# EAGLE design TEST_CPU (EAGLE 9.6.2)
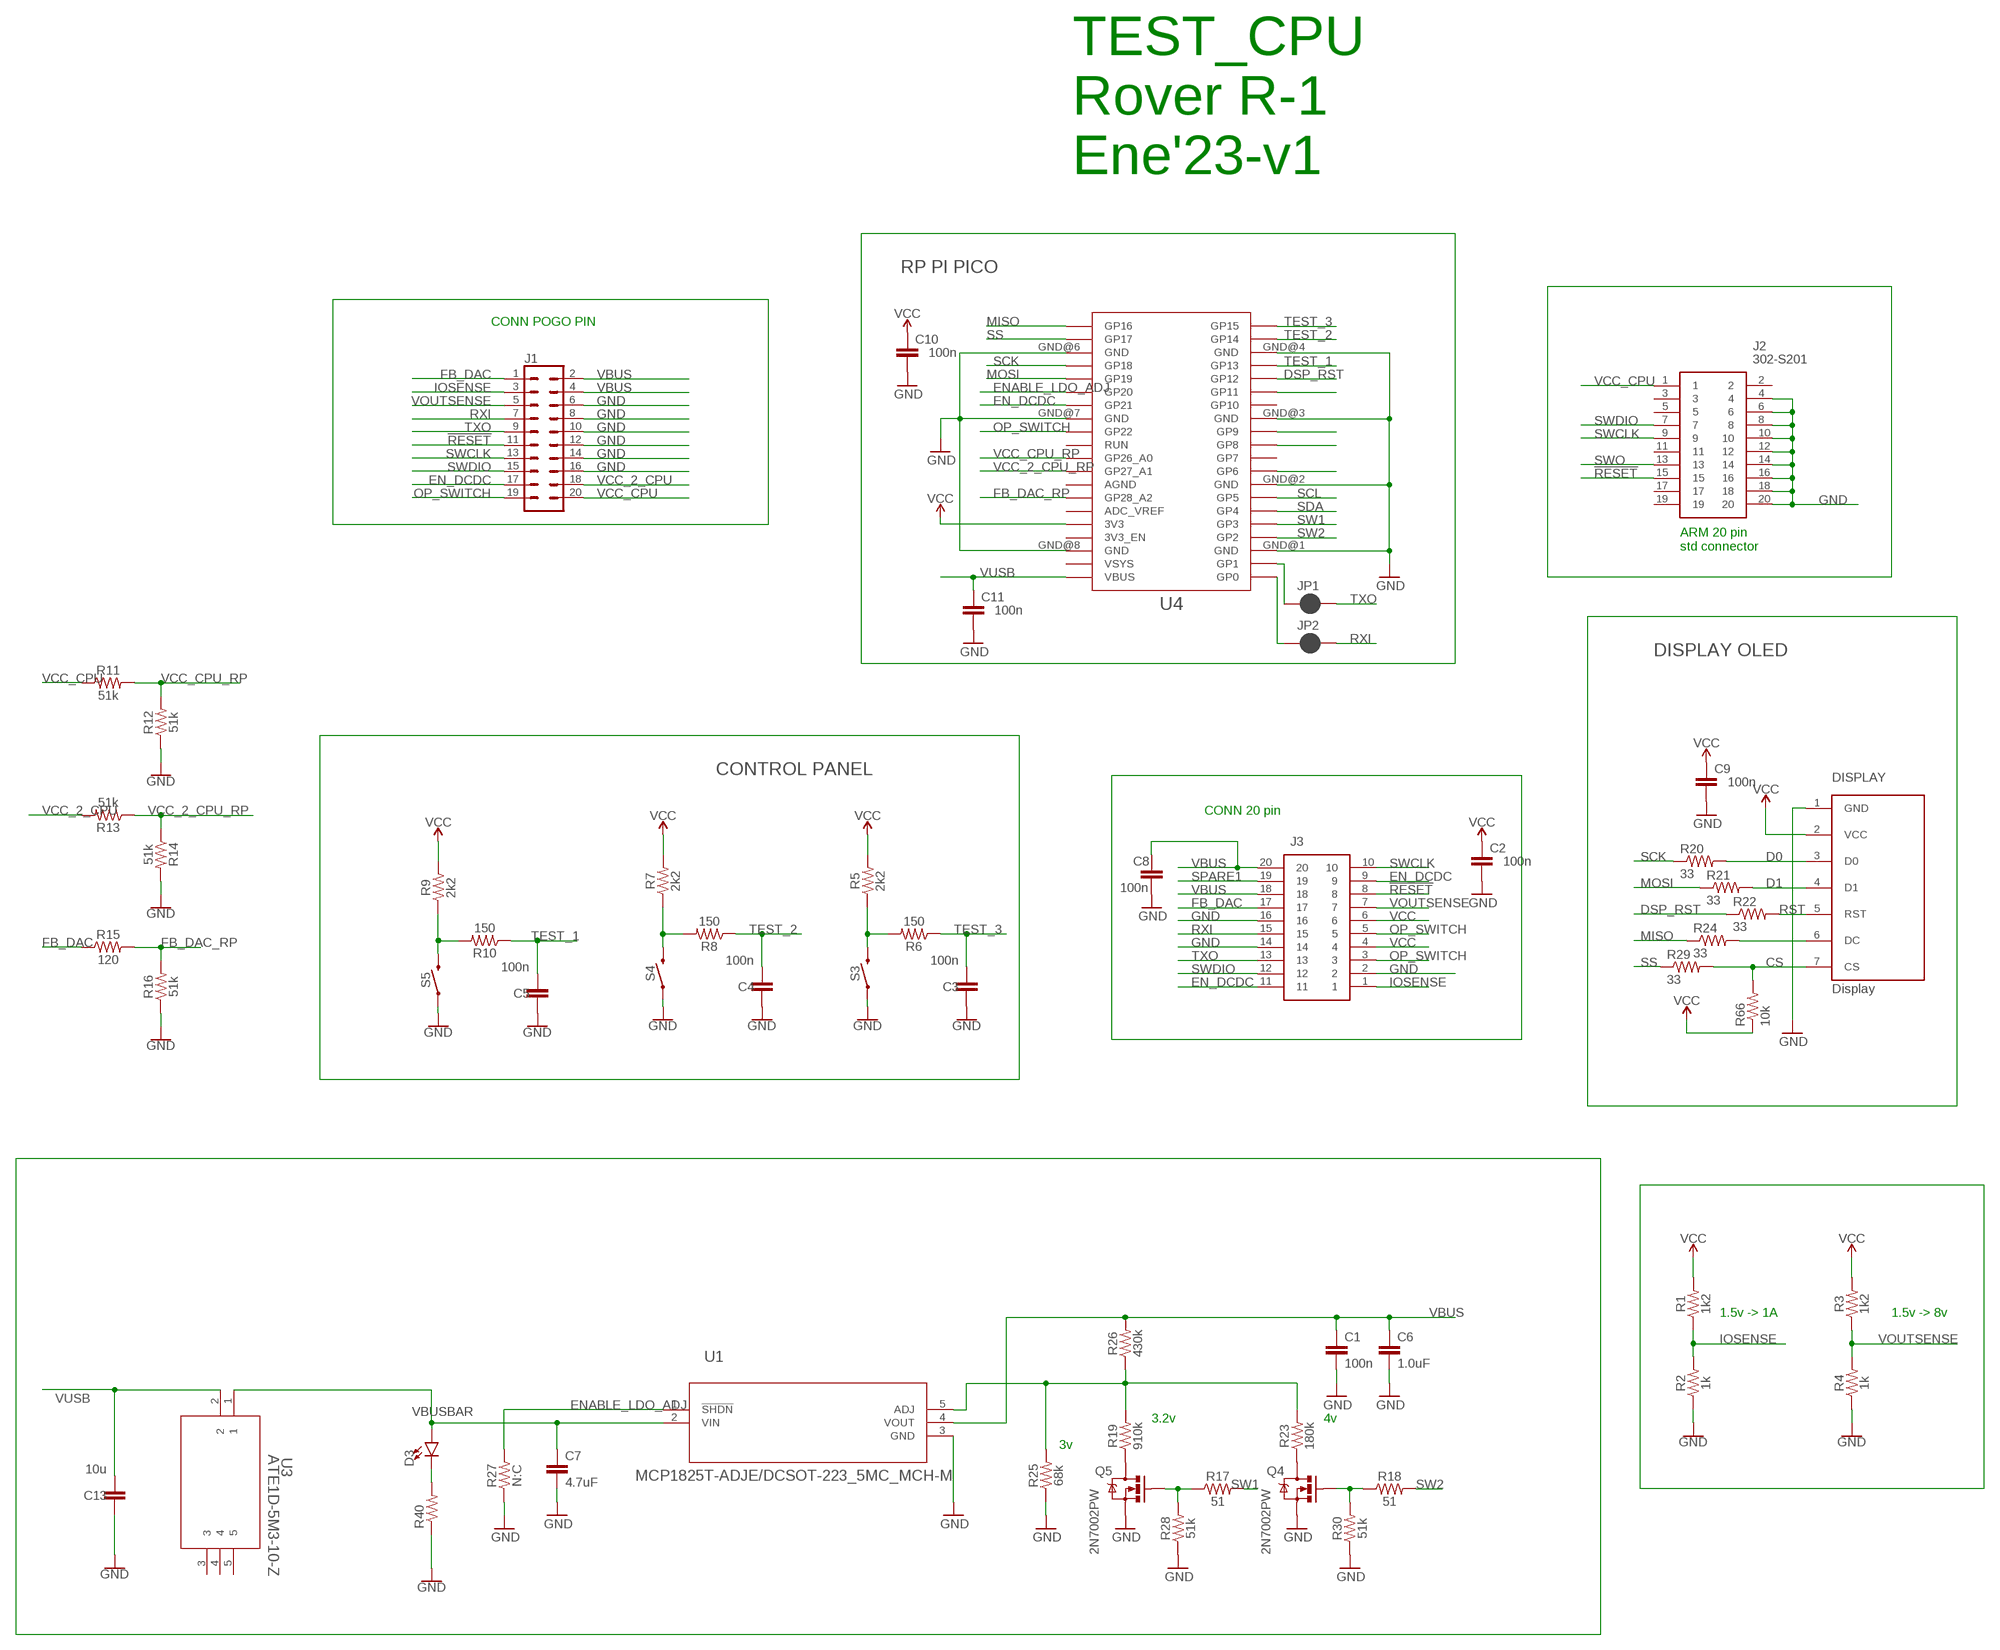
[diagram p0: schematic, sheet 1]

## Parts
C1  100n  1.0UF-0805-25V-(+80/-20%)  [0805]
C2  100n  1.0UF-0805-25V-(+80/-20%)  [0805]
C3  100n  1.0UF-0805-25V-(+80/-20%)  [0805]
C4  100n  1.0UF-0805-25V-(+80/-20%)  [0805]
C5  100n  1.0UF-0805-25V-(+80/-20%)  [0805]
C6  1.0uF  1.0UF-0805-25V-(+80/-20%)  [0805]
C7  4.7uF  1.0UF-0805-25V-(+80/-20%)  [0805]
C8  100n  1.0UF-0805-25V-(+80/-20%)  [0805]
C9  100n  1.0UF-0805-25V-(+80/-20%)  [0805]
C10  100n  1.0UF-0805-25V-(+80/-20%)  [0805]
C11  100n  1.0UF-0805-25V-(+80/-20%)  [0805]
C13  10u  1.0UF-0805-25V-(+80/-20%)  [0805]
D3  LED3MM  [LED_3MM]
DISPLAY  Display  OLED_LCD  [OLED_LCD]
J1  CONN_10X2  [2X10]
J2  302-S201  [SHDR20W66P254_2X10_3300X905X90]
J3  DF40C-20DP-0.4V_51_  [DF40C-20DPA]
JP1  JUMPER-SMT_2_NC_PASTE_SILK  [SMT-JUMPER_2_NC_PASTE_SILK]
JP2  JUMPER-SMT_2_NC_PASTE_SILK  [SMT-JUMPER_2_NC_PASTE_SILK]
Q4  2N7002PW  MOSFET-NCHANNEL2N7002PW  [SOT323]
Q5  2N7002PW  MOSFET-NCHANNEL2N7002PW  [SOT323]
R1  1k2  RESISTOR0805  [0805]
R2  1k  RESISTOR0805  [0805]
R3  1k2  RESISTOR0805  [0805]
R4  1k  RESISTOR0805  [0805]
R5  2k2  RESISTOR0805  [0805]
R6  150  RESISTOR0805  [0805]
R7  2k2  RESISTOR0805  [0805]
R8  150  RESISTOR0805  [0805]
R9  2k2  RESISTOR0805  [0805]
R10  150  RESISTOR0805  [0805]
R11  51k  RESISTOR0805  [0805]
R12  51k  RESISTOR0805  [0805]
R13  51k  RESISTOR0805  [0805]
R14  51k  RESISTOR0805  [0805]
R15  120  RESISTOR0805  [0805]
R16  51k  RESISTOR0805  [0805]
R17  51  RESISTOR0805  [0805]
R18  51  RESISTOR0805  [0805]
R19  910k  RESISTOR0805  [0805]
R20  33  RESISTOR0805  [0805]
R21  33  RESISTOR0805  [0805]
R22  33  RESISTOR0805  [0805]
R23  180k  RESISTOR0805  [0805]
R24  33  RESISTOR0805  [0805]
R25  68k  RESISTOR0805  [0805]
R26  430k  RESISTOR0805  [0805]
R27  N:C  RESISTOR0805  [0805]
R28  51k  RESISTOR0805  [0805]
R29  33  RESISTOR0805  [0805]
R30  51k  RESISTOR0805  [0805]
R40  360  RESISTOR0805  [0805]
R66  10k  RESISTOR0805  [0805]
S3  MOMENTARY-SWITCH-SPST-SMD-5.2MM  [TACTILE_SWITCH_SMD_5.2MM]
S4  MOMENTARY-SWITCH-SPST-SMD-5.2MM  [TACTILE_SWITCH_SMD_5.2MM]
S5  MOMENTARY-SWITCH-SPST-SMD-5.2MM  [TACTILE_SWITCH_SMD_5.2MM]
U1  MCP1825T-ADJE/DCSOT-223_5MC_MCH-M  [SOT-223_5MC_MCH-M]
U3  ATE1D-5M3-10-Z  [SPDT05_ATE1D_9P5X8_NDC]
U4  RPI_PICO_IG-TH  [RPI_PICO_TH]

## Nets
!RESET: J1.11 J2.15 J3.8
CS: DISPLAY.7(CS) R29.2 R66.2
D0: DISPLAY.3(D0) R20.2
D1: DISPLAY.4(D1) R21.2
DSP_RST: R22.1 U4.GP12
EN_DCDC: J1.17 J3.9 J3.11 U4.GP21
ENABLE_LDO_ADJ: R27.2 U1.1(!SHDN) U4.GP20
FB_DAC: J1.1 J3.17 R15.1
FB_DAC_RP: R15.2 R16.2 U4.GP28_A2
GND: C1.2 C2.2 C3.1 C4.1 C5.1 C6.2 C7.2 C8.2 C9.2 C10.2 C11.2 C13.1 DISPLAY.1(GND) J1.6 J1.8 J1.10 J1.12 J1.14 J1.16 J2.4 J2.6 J2.8 J2.10 J2.12 J2.14 J2.16 J2.18 J2.20 J3.2 J3.14 J3.16 Q4.2(S) Q5.2(S) R2.1 R4.1 R12.1 R14.2 R16.1 R25.1 R27.1 R28.1 R30.1 R40.1 S3.1 S4.1 S5.1 U1.3(GND) U4.GND@1(GND) U4.GND@2(GND) U4.GND@3(GND) U4.GND@4(GND) U4.GND@6(GND) U4.GND@7(GND) U4.GND@8(GND)
IOSENSE: J1.3 J3.1 R1.1 R2.2
MISO: R24.1 U4.GP16
MOSI: R21.1 U4.GP19
N$5: R5.1 R6.2 S3.3
N$7: R7.1 R8.2 S4.3
N$8: JP1.1 U4.GP1
N$9: R9.1 R10.2 S5.3
N$10: JP2.1 U4.GP0
N$11: U4.GP11
N$17: DISPLAY.6(DC) R24.2
N$20: U4.GP6
N$21: R19.2 R23.2 R25.2 R26.1 U1.5(ADJ)
N$22: U4.GP8
N$23: U4.GP9
N$27: Q5.1(G) R17.1 R28.2
N$28: D3.K(C) R40.2
N$29: Q5.3(D) R19.1
N$34: Q4.1(G) R18.1 R30.2
N$35: Q4.3(D) R23.1
OP_SWITCH: J1.19 J3.3 J3.5 U4.GP22
RST: DISPLAY.5(RST) R22.2
RXI: J1.7 J3.15 JP2.2
SCK: R20.1 U4.GP18
SCL: U4.GP5
SDA: U4.GP4
SPARE1: J3.19
SS: R29.1 U4.GP17
SW1: R17.2 U4.GP3
SW2: R18.2 U4.GP2
SWCLK: J1.13 J2.9 J3.10
SWDIO: J1.15 J2.7 J3.12
SWO: J2.13
TEST_1: C5.2 R10.1 U4.GP13
TEST_2: C4.2 R8.1 U4.GP14
TEST_3: C3.2 R6.1 U4.GP15
TXO: J1.9 J3.13 JP1.2
VBUS: C1.1 C6.1 C8.1 J1.2 J1.4 J3.18 J3.20 R26.2 U1.4(VOUT)
VBUSBAR: C7.1 D3.A U1.2(VIN) U3.1
VCC: C2.1 C9.1 C10.1 DISPLAY.2(VCC) J3.4 J3.6 R1.2 R3.2 R5.2 R7.2 R9.2 R66.1 U4.3V3
VCC_2_CPU: J1.18 R13.2
VCC_2_CPU_RP: R13.1 R14.1 U4.GP27_A1
VCC_CPU: J1.20 J2.1 R11.1
VCC_CPU_RP: R11.2 R12.2 U4.GP26_A0
VOUTSENSE: J1.5 J3.7 R3.1 R4.2
VUSB: C11.1 C13.2 U3.2 U4.VBUS
Unconnected: J2.2 J2.3 J2.5 J2.11 J2.17 J2.19 U3.3 U3.4 U3.5 U4.3V3_EN U4.ADC_VREF U4.AGND U4.GP7 U4.GP10 U4.RUN U4.VSYS

## Notes on the sheet
- TEST_CPU
  Rover R-1
  Ene'23-v1
- RP PI PICO
- CONN POGO PIN
- ARM 20 pin
  std connector
- DISPLAY OLED
- CONTROL PANEL
- CONN 20 pin
- 1.5v -> 1A | 1.5v -> 8v
- 3.2v | 4v
- 3v

## Library data of the parts
C1-C5 C7-C11 C13 = SparkFun-Capacitors:1.0UF: 1µF ceramic capacitors A capacitor is a passive two-terminal electrical component used to store electrical energy temporarily in an electric field.; PROD_ID: CAP-11625; VALUE: 1.0uF
C6 = SparkFun-Capacitors:1.0UF: 1µF ceramic capacitors A capacitor is a passive two-terminal electrical component used to store electrical energy temporarily in an electric field.; PROD_ID: CAP-11625
D3 = SparkFun-LED:LED: LED (Generic) Standard schematic elements and footprints for 5mm, 3mm, 1206, and 0603 sized LEDs. Generic LEDs with no color specified.; PROD_ID: DIO-08794
DISPLAY = EDCPSU:OLED_LCD
J1 = SparkFun-Connectors:CONN_10X2: Multi connection point. Often used as Generic Header-pin footprint for 0.1 inch spaced/style header connections On any of the 0.1 inch spaced packages, you can populate with these: Break Away Headers - Straight <https://www.sparkfun.com/products/116> (PRT-00116) Break Away Male Headers - Right Angle <https://www.sparkfun.com/products/553> (PRT-00553) Female Headers <https://www.sparkfun.com/products/115> (PRT-00115) Break Away Headers - Machine Pin <https://www.sparkfun.com/products/117> (PRT-00117) Break Away Female Headers - Swiss Machine Pin <https://www.sparkfun.com/products/743> (PRT-00743) Special note about the "SPECIAL" package: This was SPECIALLY designed to be used with our Graphic LCD Backpack. Be sure you want to use this! It is not only staggered on each line of header holes, but IT IS ALSO offset of the center point of the top and bottom lines by 5 mil. This causes the headers to lock into place on the "standard" footprint on the LCD screen. The extra squares on the tdocu layer are there simply to reference other pins (if you were to actually populate a longer header than ten long - this is what we do with the backpacks).
J2 = 302-S201:302-S201: CONN HEADER VERT 20POS GOLD Source: Datasheet <http://www.on-shore.com/wp-content/uploads/2018/04/302-SXX1.pdf>; DESCRIPTION: CONN HEADER VERT 20POS GOLD; HEIGHT: 9.05mm; MANUFACTURER_NAME: On Shore Technology Inc.; MANUFACTURER_PART_NUMBER: 302-S201
J3 = DF40C-20DP-0.4V_51_:DF40C-20DP-0.4V_51_: HIROSE(HRS) - DF40C-20DP-0.4V(51) - CONNECTOR, STACKING, HEADER, 20POS, 2ROW Source: Datasheet <https://datasheet.datasheetarchive.com/originals/distributors/Datasheets-DGA17/1059795.pdf>; ARROW_PART_NUMBER: DF40C-20DP-0.4V(51); ARROW_PRICE-STOCK: https://www.arrow.com/en/products/df40c-20dp-0.4v-51/hirose-electric; DESCRIPTION: HIROSE(HRS) - DF40C-20DP-0.4V(51) - CONNECTOR, STACKING, HEADER, 20POS, 2ROW; HEIGHT: mm; MANUFACTURER_NAME: Hirose; MANUFACTURER_PART_NUMBER: DF40C-20DP-0.4V(51); MOUSER_PART_NUMBER: 798-DF40C20DP0.4V51; MOUSER_PRICE-STOCK: https://www.mouser.co.uk/ProductDetail/Hirose-Connector/DF40C-20DP-0.4V51?qs=eDUdFcBPps31lPFyZ%252BXRFg%3D%3D
JP1 JP2 = SparkFun-Jumpers:JUMPER-SMT_2_NC_PASTE: Normally closed solder jumper This jumper has an aperture in the stencil to allow solder paste to bridge the split in the wire so it's normally closed (NC). Wick off the solder to open the connection. Reapply solder to reclose the connection.
Q4 Q5 = SparkFun-DiscreteSemi:MOSFET-NCHANNEL: Common NMOSFET Parts MFG P/N Store ID Prod ID FDD8780 TRANS-09984 SI7820DN TRANS-11055 FDS6630A IC-08089 2N7002PW TRANS-11151 FQP30N06L COM-10213 TRANS-10060 BSS123LT1G TRANS-08345 BSS138 TRANS-00830 BS170 2N7000; PROD_ID: TRANS-11151
R1-R30 R40 R66 = SparkFun-Resistors:RESISTOR: Generic Resistor Package
S3-S5 = SparkFun-Switches:MOMENTARY-SWITCH-SPST: Momentary Switch (Pushbutton) - SPST Normally-open (NO) SPST momentary switches (buttons, pushbuttons). Variants PTH-12MM - 12mm square, through-hole Momentary Pushbutton Switch - 12mm Square <https://www.sparkfun.com/products/9190> (COM-09190) PTH-6.0MM, PTH-6.0MM-KIT - 6.0mm square, through-hole Mini Pushbutton Switch <https://www.sparkfun.com/products/97> (COM-00097) KIT package intended for soldering kit's - only one side of pads' copper is exposed. PTH-RIGHT-ANGLE-KIT - Right-angle, through-hole Right Angle Tactile Button <https://www.sparkfun.com/products/10791> - Used on SparkFun BigTime Watch Kit <https://www.sparkfun.com/products/11734> SMD-12MM - 12mm square, surface-mount Tactile Button - SMD (12mm) <https://www.sparkfun.com/products/12993> (COM-12993) Used on SparkFun PicoBoard <https://www.sparkfun.com/products/11888> SMD-4.5MM - 4.5mm Square Trackball Switch Used on SparkFun Blackberry Trackballer Breakout <https://www.sparkfun.com/products/13169> SMD-4.6MMX2.8MM - 4.60mm x 2.80mm, surface mount Used on SparkFun SAMD21 Mini Breakout <https://www.sparkfun.com/products/13664> SMD-5.2MM, SMD-5.2-REDUNDANT - 5.2mm square, surface-mount Mini Pushbutton Switch - SMD <https://www.sparkfun.com/products/8720> (COM-08720) Used on Arduino Pro Mini <https://www.sparkfun.com/products/11114> REDUNDANT package connects both switch circuits together SMD-6.0X3.5MM - 6.0 x 3.5mm, surface mount Momentary Reset Switch SMD <https://www.sparkfun.com/products/8229> (COM-08229) SMD-6.2MM-TALL - 6.2mm square, surface mount Tactile Button - SMD (6mm) <https://www.sparkfun.com/products/12992> Used on SparkFun Digital Sandbox <https://www.sparkfun.com/products/12651> SMD-RIGHT-ANGLE - Right-angle, surface mount Used on SparkFun Block for Intel® Edison - Arduino <https://www.sparkfun.com/products/13036>; PROD_ID: SWCH-08247; SF_SKU: COM-08720
U1 = MCP1825T-ADJE:MCP1825T-ADJE/DC; BUILT_BY: EMA_UL_Team; MANUFACTURER_PART_NUMBER: MCP1825T-ADJE/DC; SOURCELIBRARY: Microchip_2011-05-13; VENDOR: Microchip
U3 = ATE1D-5M3-10-Z:ATE1D-5M3-10-Z; COPYRIGHT: Copyright (C) 2022 Ultra Librarian. All rights reserved.; DIGI-KEY_PART_NUMBER_1: 563-1158-ND; MANUFACTURER_PART_NUMBER: ATE1D-5M3-10-Z; MFR_NAME: Nidec Copal Electronics
U4 = RaspberryPi_Pico:RPI_PICO_IG

## Board
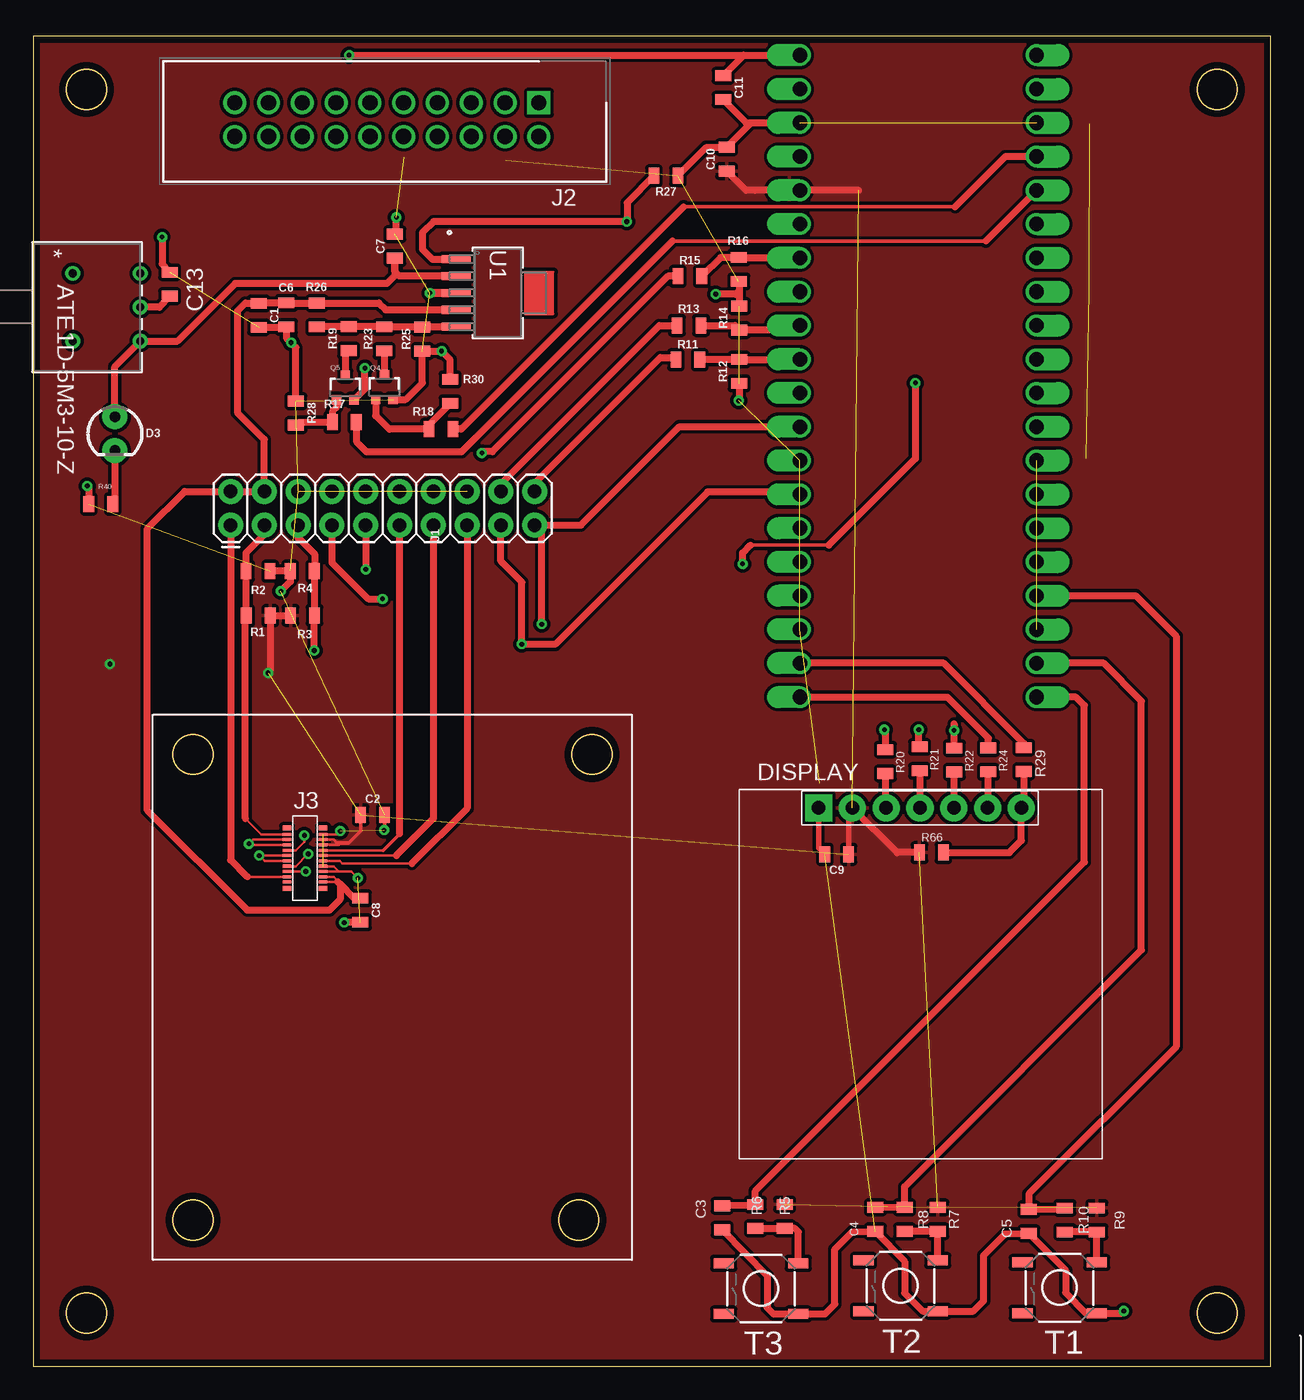
[diagram p1: board, top side]
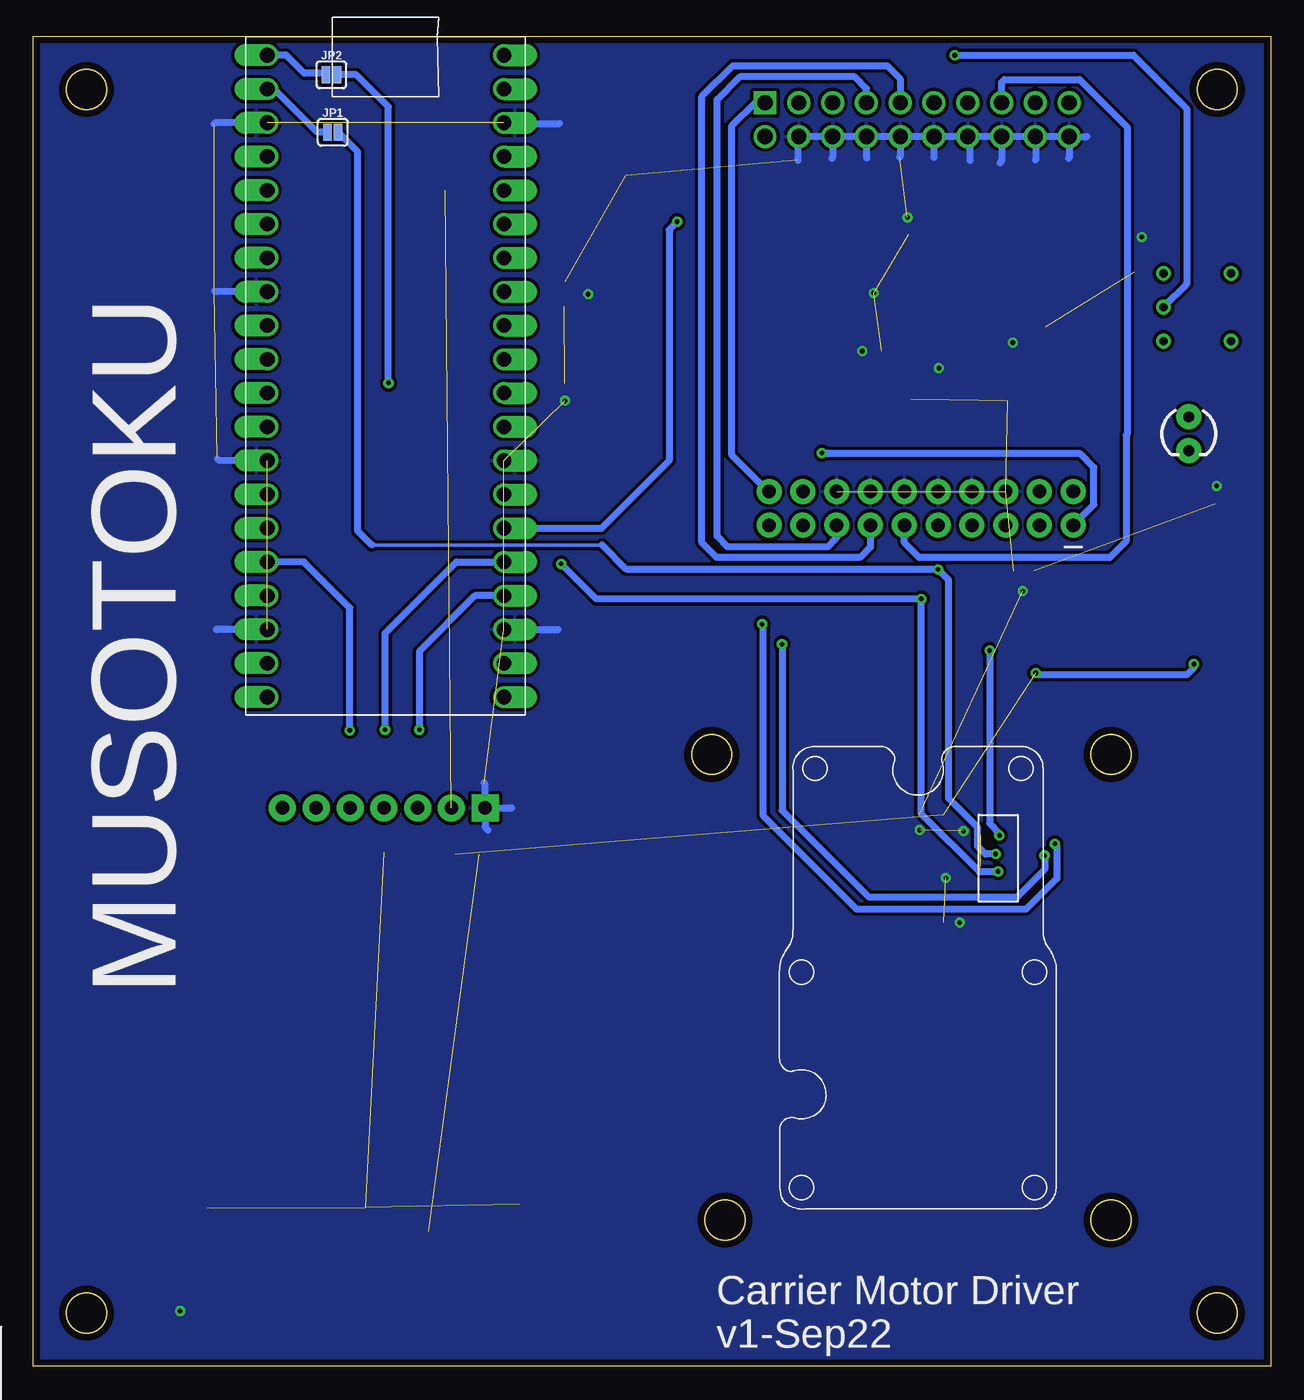
[diagram p2: board, bottom side, seen from below]

Size 93 x 100 mm. Coordinates in mm from the lower left corner, seen from the top.
Outline: 0,0 93,0 93,100 0,100 0,0
Outline: circle at 89,4 radius 1.5
Outline: circle at 89,96 radius 1.5
Outline: circle at 4,96 radius 1.5
Outline: circle at 4,4 radius 1.5
Outline: circle at 12,46 radius 1.5
Outline: circle at 12,11 radius 1.5
Outline: circle at 42,46 radius 1.5
Outline: circle at 41,11 radius 1.5
Copper layers (1*16): Top 0.035mm / dielectric 1.5mm / Bottom 0.035mm
Design rules "default *": minimum track width 6mil, minimum drill 0.35mm, track to track 8mil, track to pad 8mil, pad to pad 8mil, via to via 8mil, smd to smd 0mil, copper to edge 20mil, drill to drill 6mil, minimum pad ring 10mil, minimum via ring 8mil, stop-mask expansion 4mil, vias tented up to drill 0mil, thermal gap 10mil

### Footprints (pad centres in the part's own frame; a part is rotated, then mirrored left to right if it is on the bottom)
0805 = smd 0.8 x 1.2: 1 -0.9,0; 2 0.9,0
LED_3MM = drill 0.813 pad 1.88: A -1.27,0; K 1.27,0
OLED_LCD = drill 1.016 pad 2.032 square: 1 -7.42,13.7 | drill 1.016 pad 2.032: 2 -4.88,13.7; 3 -2.34,13.7; 4 0.2,13.7; 5 2.74,13.7; 6 5.28,13.7; 7 7.82,13.7
2X10 = drill 1.016 pad 1.88: 1 0,0; 2 0,2.54; 3 2.54,0; 4 2.54,2.54; 5 5.08,0; 6 5.08,2.54; 7 7.62,0; 8 7.62,2.54; 9 10.16,0; 10 10.16,2.54; 11 12.7,0; 12 12.7,2.54; 13 15.24,0; 14 15.24,2.54; 15 17.78,0; 16 17.78,2.54; 17 20.32,0; 18 20.32,2.54; 19 22.86,0; 20 22.86,2.54
SHDR20W66P254_2X10_3300X905X90 = drill 1.15 pad 1.725 square: 1 0,0 | drill 1.15 pad 1.725: 2 0,2.54; 3 2.54,0; 4 2.54,2.54; 5 5.08,0; 6 5.08,2.54; 7 7.62,0; 8 7.62,2.54; 9 10.16,0; 10 10.16,2.54; 11 12.7,0; 12 12.7,2.54; 13 15.24,0; 14 15.24,2.54; 15 17.78,0; 16 17.78,2.54; 17 20.32,0; 18 20.32,2.54; 19 22.86,0; 20 22.86,2.54
DF40C-20DPA = smd 0.23 x 0.66: 1 0,0; 2 0,2.71; 3 0.4,0; 4 0.4,2.71; 5 0.8,0; 6 0.8,2.71; 7 1.2,0; 8 1.2,2.71; 9 1.6,0; 10 1.6,2.71; 11 2,0; 12 2,2.71; 13 2.4,0; 14 2.4,2.71; 15 2.8,0; 16 2.8,2.71; 17 3.2,0; 18 3.2,2.71; 19 3.6,0; 20 3.6,2.71 | smd 0.35 x 0.66: 21 4.075,0; 22 4.075,2.71; 23 -0.475,2.71; 24 -0.475,0
SMT-JUMPER_2_NC_PASTE_SILK = smd 0.635 x 1.27: 1 -0.406,0; 2 0.406,0
SOT323 = smd 0.7 x 0.7: 1 -0.65,-0.925; 2 0.65,-0.925; 3 0,0.925
TACTILE_SWITCH_SMD_5.2MM = smd 1.524 x 0.762: 1 -2.794,1.905; 2 2.794,1.905; 3 -2.794,-1.905; 4 2.794,-1.905
SOT-223_5MC_MCH-M = smd 0.61 x 2.159: 1 -2.54,-3.109; 2 -1.27,-3.109; 3 0,-3.109; 4 1.27,-3.109; 5 2.54,-3.109
SPDT05_ATE1D_9P5X8_NDC = drill 0.61 pad 1.118: 1 5.08,5.08; 2 2.54,5.08; 3 0,5.08; 4 0,0; 5 5.08,0
RPI_PICO_TH = drill 1.1 pad 1.6 offset: 3V3 8.89,13.97; 3V3_EN 8.89,16.51; ADC_VREF 8.89,11.43; AGND 8.89,6.35; GND@1 -8.89,19.05; GND@2 -8.89,6.35; GND@3 -8.89,-6.35; GND@4 -8.89,-19.05; GND@6 8.89,-19.05; GND@7 8.89,-6.35; GND@8 8.89,19.05; GP0 -8.89,24.13; GP1 -8.89,21.59; GP2 -8.89,16.51; GP3 -8.89,13.97; GP4 -8.89,11.43; GP5 -8.89,8.89; GP6 -8.89,3.81; GP7 -8.89,1.27; GP8 -8.89,-1.27; GP9 -8.89,-3.81; GP10 -8.89,-8.89; GP11 -8.89,-11.43; GP12 -8.89,-13.97; GP13 -8.89,-16.51; GP14 -8.89,-21.59; GP15 -8.89,-24.13; GP16 8.89,-24.13; GP17 8.89,-21.59; GP18 8.89,-16.51; GP19 8.89,-13.97; GP20 8.89,-11.43; GP21 8.89,-8.89; GP22 8.89,-3.81; GP26_A0 8.89,1.27; GP27_A1 8.89,3.81; GP28_A2 8.89,8.89; RUN 8.89,-1.27; VBUS 8.89,24.13; VSYS 8.89,21.59

### Placement (x,y rotation side)
C1  16.94,79.02 270 top
C2  25.51,41.46 0 top
C3  51.77,11.16 90 top
C4  63.29,11.05 90 top
C5  74.84,10.9 90 top
C6  19.03,79.05 270 top
C7  27.18,84.22 90 top
C8  24.58,34.29 270 top
C9  60.39,38.5 180 top
C10  52.12,90.76 90 top
C11  51.85,96.14 270 top
C13  10.25,81.36 270 top
D3  6.14,70.12 270 top
DISPLAY  66.45,28.28 0 top
J1  14.83,63.24 0 top
J2  38,95 180 top
J3  19.07,40 270 top
JP1  70.49,92.79 0 bottom
JP2  70.59,97.11 0 bottom
Q4  26.39,73.61 0 top
Q5  23.45,73.58 0 top
R1  16.91,56.44 0 top
R2  16.9,59.78 180 top
R3  20.24,56.46 180 top
R4  20.22,59.78 0 top
R5  56.48,11.27 90 top
R6  54.28,11.27 270 top
R7  67.99,11.05 90 top
R8  65.49,11.05 270 top
R9  79.94,11 90 top
R10  77.54,11 270 top
R11  49.2,75.68 0 top
R12  53.05,74.8 90 top
R13  49.29,78.25 180 top
R14  53.07,78.81 90 top
R15  49.35,81.95 0 top
R16  53.03,82.47 90 top
R17  23.38,70.99 0 top
R18  30.65,70.45 0 top
R19  23.71,77.27 90 top
R20  64.05,45.47 270 top
R21  66.62,45.67 270 top
R22  69.24,45.58 270 top
R23  26.38,77.24 90 top
R24  71.79,45.59 270 top
R25  29.24,77.23 90 top
R26  21.32,79.04 90 top
R27  47.55,89.51 180 top
R28  19.74,71.67 270 top
R29  74.45,45.62 270 top
R30  31.34,73.3 270 top
R40  5.07,64.83 0 top
R66  67.51,38.62 0 top
S3  54.7,5.84 180 top
S4  65.19,6.05 180 top
S5  77.14,5.9 180 top
U1  34.91,80.7 270 top
U3  2.97,82.17 270 top
U4  66.52,74.45 0 bottom

### Tracks (layer width: path | path; a pad name or v marks a point on that pad's centre or on a via)
!RESET
  Top 0.203: 26.29,38.8 J3.8
  Top 0.254: 26.29,38.8 27.53,40.04
  Top 0.508: 27.53,40.04 J1.11
  Bottom 0.508: J2.15 20.21,96.53 20,96.74 14.36,96.74 10.77,93.15 10.77,70.08 10.86,69.99 10.86,62.04 12.1,60.8 26.4,60.8 27.53,61.93 J1.11
CS
  Top 0.508: R29.2 74.45,42.16 DISPLAY.7 74.27,39.52 73.37,38.62 R66.2
D0
  Top 0.508: R20.2 64.05,42.04 DISPLAY.3
D1
  Top 0.508: R21.2 66.62,42.01 DISPLAY.4
DSP_RST  (via drill 0.35)
  Top 0.508: v69.21,47.82 69.21,48.29 69.22,48.3 69.22,46.5 R22.1
  Bottom 0.508: v69.21,47.82 69.21,57.03 72.66,60.48 U4.GP12
EN_DCDC  (via drill 0.35)
  Top 0.203: J3.9 v16.99,38.4 17.39,38 J3.11
  Top 0.508: U4.GP21 57.45,65.74 50.69,65.74 39.22,54.27 36.75,54.27 v36.72,54.3 36.72,58.96 35.15,60.53 J1.17
  Bottom 0.508: v36.72,54.3 36.72,41.8 30.21,35.29 19.05,35.29 16.99,37.35 v16.99,38.4
ENABLE_LDO_ADJ  (via drill 0.35)
  Top 0.508: v44.61,86.06 44.63,86.08 | 44.63,86.08 30.09,86.08 29.25,85.24 29.25,83.99 30,83.24 U1.1 | R27.2 44.63,87.49 44.63,86.08
  Bottom 0.508: U4.GP20 50.28,63.02 45.21,68.09 45.21,85.46 v44.61,86.06
FB_DAC  (via drill 0.35)
  Top 0.203: J3.17 16.09,36.8
  Top 0.508: R15.1 47.68,81.95 34.5,68.77 33.82,68.77 v33.72,68.67 | 16.09,36.8 14.83,38.06 J1.1
  Bottom 0.508: J1.1 13.28,64.79 13.28,67.58 14.32,68.62 33.23,68.62 33.28,68.67 v33.72,68.67
FB_DAC_RP
  Top 0.508: U4.GP28_A2 57.6,83.37 R16.2 51.67,83.37 R15.2
GND  (via drill 0.35)  (29 unrouted)
  Top 0.203: J3.2 22.84,40 v23.08,40.24 | J3.14 22.58,37.6 22.98,37.2 | J3.16 22.98,37.2 | 22.98,37.2 23.91,37.2 v24.41,36.7
  Top 0.254: C2.2 26.41,40.43 26.44,40.4 26.44,40.38 v26.38,40.31
  Top 0.406: C9.2 59.03,38.96 DISPLAY.1
  Top 0.508: R2.1 R4.1 19.32,58.99 v18.61,58.28 | C3.1 55.16,6.82 55.16,4.4 55.62,3.93 S3.1 59.52,3.93 60.25,4.67 60.25,8.8 61.55,10.1 C4.1 65.5,7.89 65.5,5.49 66.84,4.14 S4.1 70.67,4.14 71.43,4.91 71.43,8.33 73.05,9.95 C5.1 77.59,7.2 77.59,5.53 79.12,4 S5.1 81.81,4 v81.96,4.15 | Q4.2 27.98,72.69 29.24,73.94 R25.1 v30.69,76.33 31.34,75.68 R30.1 | Q5.2 24.93,73.48 v24.93,75.05 | C13.1 9.68,82.88 v9.68,84.91 | v4.06,66.19 4.17,66.08 R40.1 | C7.2 27.29,85.18 v27.29,86.38 | R16.1 53.07,81.53 53.07,80.88 | 53.07,80.88 R14.2 | 53.07,80.88 52.8,80.61 v51.3,80.61 | R12.1 53.05,72.62 v53.03,72.6 | C1.2 19,78.12 C6.2 19.03,77.32 v19.38,76.97 19.74,76.61 R28.1 | C8.2 23.36,33.39 23.35,33.38 v23.37,33.36 | C11.2 53.59,93.5 U4.GND@8 53.96,93.5 C10.2 50.6,91.66 R27.1
  Top 0.61: U1.3 v29.82,80.7
  Bottom 0.508: DISPLAY.1 59.03,43.78 59.11,43.86 | DISPLAY.1 57.07,41.98 57.05,41.96 | DISPLAY.1 59.03,40.52 58.83,40.32 | U4.GND@4 79.22,55.4 79.24,55.38 | U4.GND@3 79.03,68.1 79.16,68.23 | U4.GND@2 79.32,80.8 79.38,80.86 | U4.GND@1 79.33,93.5 79.41,93.42 | U4.GND@8 57.57,93.44 53.45,93.44 | U4.GND@6 53.55,55.4 53.54,55.39 | J2.20 J2.18 | J2.18 J2.16 | J2.16 J2.14 | J2.14 J2.12 | J2.12 J2.10 | J2.10 J2.8 | J2.8 J2.6 | J2.6 J2.4 35.52,92.4 35.52,90.68 | J2.6 32.92,90.88 32.98,90.82 | J2.8 30.38,90.89 30.34,90.85 | J2.10 27.84,90.95 27.88,90.91 | J2.12 25.3,90.91 25.28,90.89 | J2.14 22.6,92.3 22.6,90.66 | J2.16 20.22,90.62 20.35,90.49 | J2.18 17.65,92.43 17.65,90.7 | J2.20 15.14,90.85 15.17,90.82 | J2.20 13.8,92.46 13.78,92.48
  pour Bottom (isolate 0.254, rank 2): -5.26,103.73 -5.26,-2.89 95.56,-2.89 95.56,103.73 94.74,103.73
IOSENSE
  Top 0.203: J3.1 17.13,40 15.95,41.18
  Top 0.508: J1.3 17.37,62.55 16,61.18 R2.2 R1.1 16.01,56.29 15.95,56.23 15.95,41.18
MISO
  Top 0.508: U4.GP16 68.7,50.32 71.79,47.23 R24.1
MOSI  (via drill 0.35)
  Top 0.508: R21.1 66.56,46.63 v66.56,47.86
  Bottom 0.508: v66.56,47.86 66.56,55.12 61.2,60.48 U4.GP19
N$5
  Top 0.508: S3.3 57.51,7.77 57.51,10.1 57.24,10.37 R5.1 R6.2
N$7
  Top 0.508: R8.2 R7.1 S4.3
N$8
  Bottom 0.508: JP1.1 71.64,92.79 74.89,96.04 U4.GP1
N$9
  Top 0.508: R10.2 R9.1 S5.3
N$10
  Bottom 0.508: JP2.1 71.11,97.22 72.63,97.22 73.99,98.58 U4.GP0
N$17
  Top 0.508: R24.2 71.79,42.04 DISPLAY.6
N$21
  Top 0.508: U1.5 31.77,78.13 R25.2 R23.2 26.35,78.17 R19.2 21.35,78.17 R26.1
N$27
  Top 0.508: Q5.1 22.8,72.12 22.48,71.8 R17.1 19.96,70.99 R28.2
N$28
  Top 0.508: R40.2 6.14,65 D3.K
N$29
  Top 0.508: R19.1 23.45,76.11 Q5.3
N$34
  Top 0.508: Q4.1 25.74,71.48 26.77,70.45 R18.1 29.75,70.81 R30.2
N$35
  Top 0.508: R23.1 26.38,74.55 Q4.3
OP_SWITCH  (via drill 0.35)
  Top 0.203: J3.5 16.29,39.2 v16.21,39.28 16.53,39.6 J3.3
  Top 0.508: U4.GP22 48.57,70.64 41.17,63.24 J1.19 38.22,62.71 v38.22,55.8
  Bottom 0.508: v16.21,39.28 16.07,39.14 16.07,36.67 18.37,34.37 31.14,34.37 38.13,41.36 38.13,55.71 v38.22,55.8
RST
  Top 0.508: R22.2 69.19,44.63 DISPLAY.5
RXI  (via drill 0.35)
  Top 0.203: v20.49,37.2 J3.15
  Top 0.254: 53.91,61.74 59.81,61.74
  Top 0.508: J1.7 22.45,60.43 25.18,57.7 v26.25,57.7 | v66.3,73.93 66.3,68.23 59.81,61.74 | v53.32,60.33 53.32,61.15 53.91,61.74
  Bottom 0.508: v66.3,73.93 66.3,94.69 68.72,97.11 JP2.2 | v20.49,37.2 21.91,37.2 26.28,41.57 26.28,57.67 v26.25,57.7 v26.26,57.69 50.68,57.69 v53.32,60.33
SCK  (via drill 0.35)
  Top 0.508: v63.98,47.86 64.05,47.79 R20.1
  Bottom 0.508: U4.GP18 59.8,57.94 63.98,53.76 v63.98,47.86
SS
  Top 0.508: R29.1 74.45,46.83 68.42,52.86 U4.GP17
SW1
  Top 0.254: 48.03,84.61 71.6,84.61
  Top 0.508: R17.2 24.28,69.53 25.04,68.77 32.19,68.77 48.03,84.61 | 71.6,84.61 U4.GP3
SW2
  Top 0.254: 69.29,87.18 48.89,87.18
  Top 0.508: U4.GP2 73.07,90.96 69.29,87.18 | R18.2 32.16,70.45 48.89,87.18
SWCLK
  Top 0.203: J3.10 27.29,38.4
  Top 0.508: J1.13 30.07,41.18 27.29,38.4
  Bottom 0.508: J1.13 30.07,61.59 30.84,60.82 41.64,60.82 42.74,61.92 42.74,95.48 40.44,97.78 28.81,97.78 27.84,96.81 J2.9
SWDIO
  Top 0.203: 28.46,37.79 23.24,37.79 23.03,38 J3.12
  Top 0.508: 28.46,37.79 32.62,41.95 J1.15
  Bottom 0.508: J2.7 30.38,96.07 31.27,96.96 39.89,96.96 41.6,95.25 41.6,62.41 40.8,61.61 33.3,61.61 32.61,62.3 J1.15
TEST_1
  Top 0.508: R10.1 77.49,11.85 C5.2 74.84,12.96 85.91,24.03 85.91,54.89 82.86,57.94 U4.GP13
TEST_2
  Top 0.508: C4.2 65.44,12 R8.1 65.49,13.5 83.29,31.3 83.29,50.02 80.45,52.86 U4.GP14
TEST_3
  Top 0.508: C3.2 54.22,12.11 R6.1 54.28,13.19 79,37.91 79,49.69 78.37,50.32 U4.GP15
TXO  (via drill 0.35)
  Top 0.203: J3.13 19.72,37.6 20.64,38.52 v20.67,38.52
  Top 0.508: J1.9 v24.99,59.92
  Bottom 0.254: 67.55,61.75 50.25,61.75
  Bottom 0.508: 50.25,61.75 48.45,59.95 25.02,59.95 v24.99,59.92 24.22,59.15 24.22,42.73 22.03,40.54 22.03,39.12 21.43,38.52 v20.67,38.52 | 67.55,61.75 68.61,62.81 68.61,91.32 JP1.2
VBUS
  Top 0.203: J3.18 22.57,36.8 22.91,36.46 22.89,36.44 22.85,36.4 J3.20
  Top 0.508: U1.4 26.49,79.43 25.98,79.94 R26.2 C6.1 16.97,79.95 | 23.11,36.21 23.11,35.15 22.27,34.31 16.07,34.31 8.58,41.8 8.58,62.98 11.38,65.78 J1.2 J1.4 17.37,69.68 15.34,71.71 15.34,79.34 15.95,79.95 16.97,79.95 | 23.11,36.21 22.89,36.44 | 16.97,79.95 C1.1 | C8.1 24.13,35.19 23.11,36.21
VBUSBAR
  Top 0.508: U1.2 27.5,81.97 27.18,82.29 C7.1 27.18,82.02 26.58,81.42 15.18,81.42 10.85,77.09 U3.1 6.14,75.18 D3.A
VCC  (via drill 0.35)  (7 unrouted)
  Top 0.203: J3.4 22.58,39.6 22.82,39.36 22.97,39.21 22.25,39.21 22.24,39.22 21.78,39.22 | 21.78,39.22
  Top 0.254: C2.1 24.61,40.26 23.71,39.36 22.82,39.36
  Top 0.406: C9.1 61.29,41.7 DISPLAY.2
  Top 0.508: R3.2 17.83,56.46 R1.2 17.81,52.29 v17.65,52.13 | R66.1 64.93,38.62 DISPLAY.2 | 62.03,88.42 U4.3V3 54.24,88.42 | 54.24,88.42 54.22,88.4 | 54.24,88.42 53.56,88.42 C10.1
  Bottom 0.508: v17.65,52.13 17.55,52.03 6.25,52.03 5.76,52.52 v5.76,52.8
  pour Top (isolate 0.254): -5,104 95.19,104 95.19,-2.81 95,-3 -5,-3
VCC_2_CPU
  Top 0.508: J1.18 35.15,66.34 47.06,78.25 R13.2
VCC_2_CPU_RP
  Top 0.508: R13.1 52.73,78.25 R14.1 57.28,77.91 U4.GP27_A1
VCC_CPU
  Top 0.508: J1.20 37.69,66.39 47.14,75.84 48.14,75.84 R11.1
  Bottom 0.508: J2.1 38.75,95 40.52,93.23 40.52,68.55 37.75,65.78 J1.20
VCC_CPU_RP
  Top 0.508: U4.GP26_A0 57.61,75.7 R12.2 50.12,75.7 R11.2
VOUTSENSE  (via drill 0.35)
  Top 0.203: v20.38,39.91 20.38,39.44 19.74,38.8 J3.7
  Top 0.508: J1.5 19.91,62.31 21.14,61.08 21.14,59.8 R4.2 21.12,56.52 21.1,56.5 R3.1 21.12,56.44 v21.12,53.82
  Bottom 0.508: v20.38,39.91 20.38,40.08 21.12,40.82 v21.12,53.82
VUSB  (via drill 0.35)
  Top 0.508: C13.2 9.47,79.63 U3.2 | v23.74,98.58 53.39,98.58 | U4.VBUS 56.58,98.58 53.39,98.58 | C11.1 53.39,98.58
  Bottom 0.508: v23.74,98.58 10.31,98.58 6.3,94.57 6.3,81.38 U3.2

### Text on the board
tNames: T3 | T2 | T1
bNames: MUSOTOKU | Carrier Motor Driver / v1-Sep22